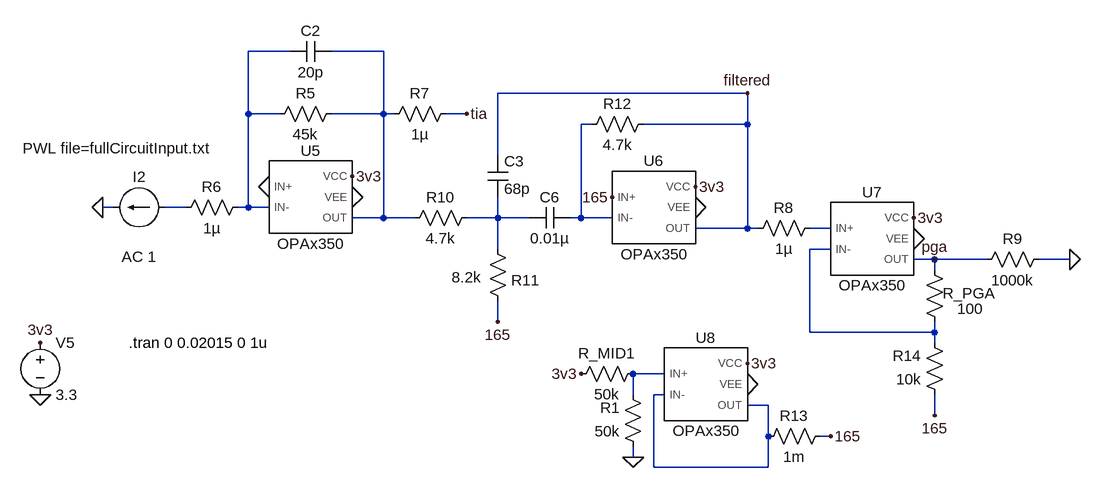
[diagram p0: schematic circuit_full_real.asc]
circuit_full_real.asc, the LTspice schematic file:
Version 4.1
SHEET 1 1996 1696
WIRE 0 800 -64 800
WIRE 144 800 64 800
WIRE 704 864 320 864
WIRE -64 896 -64 800
WIRE -16 896 -64 896
WIRE 144 896 144 800
WIRE 144 896 64 896
WIRE 160 896 144 896
WIRE 272 896 240 896
WIRE 464 912 448 912
WIRE 704 912 704 864
WIRE 704 912 544 912
WIRE 320 960 320 864
WIRE -272 1040 -288 1040
WIRE -160 1040 -192 1040
WIRE -64 1040 -64 896
WIRE -64 1040 -80 1040
WIRE -32 1040 -64 1040
WIRE 144 1056 144 896
WIRE 144 1056 96 1056
WIRE 192 1056 144 1056
WIRE 320 1056 320 1024
WIRE 320 1056 272 1056
WIRE 368 1056 320 1056
WIRE 448 1056 448 912
WIRE 448 1056 432 1056
WIRE 496 1056 448 1056
WIRE 704 1072 704 912
WIRE 704 1072 624 1072
WIRE 720 1072 704 1072
WIRE 832 1072 800 1072
WIRE 320 1104 320 1056
WIRE 832 1104 800 1104
WIRE 992 1120 960 1120
WIRE 1072 1120 992 1120
WIRE 1200 1120 1152 1120
WIRE 992 1136 992 1120
WIRE 320 1216 320 1184
WIRE 800 1232 800 1104
WIRE 992 1232 992 1216
WIRE 992 1232 800 1232
WIRE 992 1248 992 1232
WIRE 576 1296 528 1296
WIRE 528 1328 528 1296
WIRE 576 1328 560 1328
WIRE 736 1344 704 1344
WIRE 992 1360 992 1328
WIRE 736 1392 736 1344
WIRE 832 1392 816 1392
WIRE 528 1424 528 1408
WIRE 560 1440 560 1328
WIRE 736 1440 736 1392
WIRE 736 1440 560 1440
FLAG 96 992 3v3
FLAG 96 1024 0
FLAG -288 1040 0
FLAG 624 1008 3v3
FLAG 624 1040 0
FLAG 704 864 filtered
FLAG -384 1328 0
FLAG -384 1248 3v3
FLAG 320 1216 165
FLAG 496 1024 165
FLAG 960 1056 3v3
FLAG 960 1088 0
FLAG 992 1360 165
FLAG -32 1008 0
FLAG 992 1120 pga
FLAG 528 1424 0
FLAG 448 1296 3v3
FLAG 704 1280 3v3
FLAG 704 1312 0
FLAG 832 1392 165
FLAG 272 896 tia
FLAG 1200 1120 0
SYMBOL res 80 880 R90
WINDOW 0 0 56 VBottom 2
WINDOW 3 32 56 VTop 2
SYMATTR InstName R5
SYMATTR Value 45k
SYMBOL cap 64 784 R90
WINDOW 0 0 32 VBottom 2
WINDOW 3 32 32 VTop 2
SYMATTR InstName C2
SYMATTR Value 20p
SYMBOL res -64 1024 R90
WINDOW 0 0 56 VBottom 2
WINDOW 3 32 56 VTop 2
SYMATTR InstName R6
SYMATTR Value 1µ
SYMBOL current -192 1040 R90
WINDOW 0 -32 40 VBottom 2
WINDOW 3 -107 75 VTop 2
WINDOW 123 60 40 VTop 2
WINDOW 39 0 0 Left 0
SYMATTR InstName I2
SYMATTR Value PWL file=fullCircuitInput.txt
SYMATTR Value2 AC 1
SYMBOL res 288 1040 R90
WINDOW 0 0 56 VBottom 2
WINDOW 3 32 56 VTop 2
SYMATTR InstName R10
SYMATTR Value 4.7k
SYMBOL res 336 1200 R180
WINDOW 0 -49 48 Left 2
WINDOW 3 41 53 Left 2
SYMATTR InstName R11
SYMATTR Value 8.2k
SYMBOL cap 304 960 R0
WINDOW 0 26 9 Left 2
WINDOW 3 26 51 Left 2
SYMATTR InstName C3
SYMATTR Value 68p
SYMBOL cap 432 1040 R90
WINDOW 0 0 32 VBottom 2
WINDOW 3 32 32 VTop 2
SYMATTR InstName C6
SYMATTR Value 0.01µ
SYMBOL res 560 896 R90
WINDOW 0 0 56 VBottom 2
WINDOW 3 32 56 VTop 2
SYMATTR InstName R12
SYMATTR Value 4.7k
SYMBOL voltage -384 1232 R0
WINDOW 123 0 0 Left 0
WINDOW 39 0 0 Left 0
SYMATTR InstName V5
SYMATTR Value 3.3
SYMBOL res 1008 1232 R180
WINDOW 0 -77 60 Left 2
WINDOW 3 -59 36 Left 2
SYMATTR InstName R_PGA
SYMATTR Value 100
SYMBOL res 1008 1344 R180
WINDOW 0 36 76 Left 2
WINDOW 3 36 40 Left 2
SYMATTR InstName R14
SYMATTR Value 10k
SYMBOL res 544 1280 R90
WINDOW 0 0 56 VBottom 2
WINDOW 3 32 56 VTop 2
SYMATTR InstName R_MID1
SYMATTR Value 50k
SYMBOL res 544 1424 R180
WINDOW 0 36 76 Left 2
WINDOW 3 36 40 Left 2
SYMATTR InstName R1
SYMATTR Value 50k
SYMBOL res 256 880 R90
WINDOW 0 0 56 VBottom 2
WINDOW 3 32 56 VTop 2
SYMATTR InstName R7
SYMATTR Value 1µ
SYMBOL res 816 1056 R90
WINDOW 0 0 56 VBottom 2
WINDOW 3 32 56 VTop 2
SYMATTR InstName R8
SYMATTR Value 1µ
SYMBOL res 1168 1104 R90
WINDOW 0 0 56 VBottom 2
WINDOW 3 32 56 VTop 2
SYMATTR InstName R9
SYMATTR Value 1000k
SYMBOL res 832 1376 R90
WINDOW 0 0 56 VBottom 2
WINDOW 3 32 56 VTop 2
SYMATTR InstName R13
SYMATTR Value 1m
SYMBOL LTSpiceModels\\sbom071e\\OPAx350 32 1024 R0
SYMATTR InstName U5
SYMBOL LTSpiceModels\\sbom071e\\OPAx350 560 1040 R0
SYMATTR InstName U6
SYMBOL LTSpiceModels\\sbom071e\\OPAx350 896 1088 R0
SYMATTR InstName U7
SYMBOL LTSpiceModels\\sbom071e\\OPAx350 640 1312 R0
SYMATTR InstName U8
TEXT -248 1248 Left 2 !.tran 0 0.02015 0 1u

The netlist it stands for:
* circuit_full_real.asc
R5 N002 N001 45k
C2 N002 N001 20p
R6 N001 N004 1µ
I2 N004 0 PWL file=fullCircuitInput.txt AC 1
R10 N005 N002 4.7k
R11 165 N005 8.2k
C3 filtered N005 68p
C6 N003 N005 0.01µ
R12 filtered N003 4.7k
V5 3v3 0 3.3
R_PGA N007 pga 100
R14 165 N007 10k
R_MID1 N008 3v3 50k
R1 0 N008 50k
R7 tia N002 1µ
R8 N006 filtered 1µ
R9 0 pga 1000k
R13 165 N009 1m
X§U5 0 N001 3v3 0 N002 OPAx350  ; pins IN+ IN- VCC VEE OUT
X§U6 165 N003 3v3 0 filtered OPAx350  ; pins IN+ IN- VCC VEE OUT
X§U7 N006 N007 3v3 0 pga OPAx350  ; pins IN+ IN- VCC VEE OUT
X§U8 N008 N009 3v3 0 N009 OPAx350  ; pins IN+ IN- VCC VEE OUT
.tran 0 0.02015 0 1u
.lib C:\Users\jpulu\OneDrive\Área de Trabalho\TCC\LTSpiceModels\sbom071e\OPAx350.LIB
.backanno
.end